# EAGLE design Lichtschranke_ArduinoBoard (EAGLE 6.4)
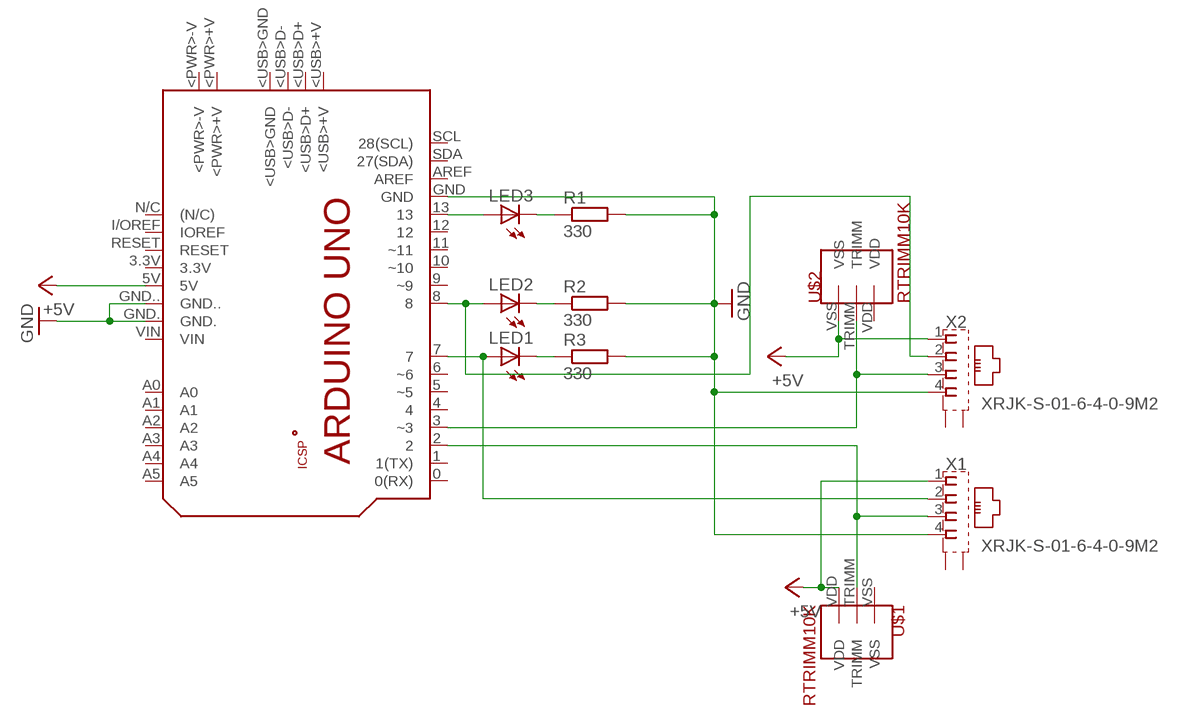
[diagram p0: schematic, sheet 1]

## Parts
LED1  LED5MM  [LED5MM]
LED2  LED5MM  [LED5MM]
LED3  LED5MM  [LED5MM]
PCB1  ARDUINO_UNO  [ARDUINO_UNO]
R1  330  R-EU_0411/12  [0411/12]
R2  330  R-EU_0411/12  [0411/12]
R3  330  R-EU_0411/12  [0411/12]
U$1  RTRIMM10K  [RTRIMM10K]
U$2  RTRIMM10K  [RTRIMM10K]
X1  XRJK-S-01-6-4-0-9M2  [XRJK-S-01-6-4-0-9M2]
X2  XRJK-S-01-6-4-0-9M2  [XRJK-S-01-6-4-0-9M2]

## Nets
+5V: PCB1.5V U$1.VDD U$2.VSS X1.1 X2.1
GND: PCB1.GND PCB1.GND. PCB1.GND.. R1.2 R2.2 R3.2 X1.4 X2.4
N$1: PCB1.3(~3) U$2.TRIMM X2.3
N$2: LED1.A PCB1.7 X1.2
N$3: LED2.A PCB1.8 X2.2
N$4: PCB1.2 U$1.TRIMM X1.3
N$5: LED3.A PCB1.13
N$6: LED3.K(C) R1.1
N$7: LED2.K(C) R2.1
N$8: LED1.K(C) R3.1
Unconnected: PCB1.0(0(RX)) PCB1.1(1(TX)) PCB1.3.3V PCB1.4 PCB1.5(~5) PCB1.6(~6) PCB1.9(~9) PCB1.10(~10) PCB1.11(~11) PCB1.12 PCB1.+5V PCB1.<PWR>+V PCB1.<PWR>-V PCB1.<USB>+V PCB1.<USB>D+ PCB1.<USB>D- PCB1.<USB>GND PCB1.A0 PCB1.A1 PCB1.A2 PCB1.A3 PCB1.A4 PCB1.A5 PCB1.AREF PCB1.GND_ PCB1.I/OREF(IOREF) PCB1.MISO PCB1.MOSI PCB1.N/C((N/C)) PCB1.RESET PCB1.RESET. PCB1.SCK PCB1.SCL(28(SCL)) PCB1.SDA(27(SDA)) PCB1.VIN U$1.VSS U$2.VDD X1.S1(S) X1.S2(S) X2.S1(S) X2.S2(S)

## Library data of the parts
LED1-LED3 = led:LED: LED OSRAM: - CHIPLED LG R971, LG N971, LY N971, LG Q971, LY Q971, LO R971, LY R971 LH N974, LH R974 LS Q976, LO Q976, LY Q976 LO Q996 - Hyper CHIPLED LW Q18S LB Q993, LB Q99A, LB R99A - SideLED LS A670, LO A670, LY A670, LG A670, LP A670 LB A673, LV A673, LT A673, LW A673 LH A674 LY A675 LS A676, LA A676, LO A676, LY A676, LW A676 LS A679, LY A679, LG A679 - Hyper Micro SIDELED® LS Y876, LA Y876, LO Y876, LY Y876 LT Y87S - SmartLED LW L88C, LW L88S LB L89C, LB L89S, LG L890 LS L89K, LO L89K, LY L89K LS L896, LA L896, LO L896, LY L896 - TOPLED LS T670, LO T670, LY T670, LG T670, LP T670 LSG T670, LSP T670, LSY T670, LOP T670, LYG T670 LG T671, LOG T671, LSG T671 LB T673, LV T673, LT T673, LW T673 LH T674 LS T676, LA T676, LO T676, LY T676, LB T676, LH T676, LSB T676, LW T676 LB T67C, LV T67C, LT T67C, LS T67K, LO T67K, LY T67K, LW E67C LS E67B, LA E67B, LO E67B, LY E67B, LB E67C, LV E67C, LT E67C LW T67C LS T679, LY T679, LG T679 LS T770, LO T770, LY T770, LG T770, LP T770 LB T773, LV T773, LT T773, LW T773 LH T774 LS E675, LA E675, LY E675, LS T675 LS T776, LA T776, LO T776, LY T776, LB T776 LHGB T686 LT T68C, LB T68C - Hyper Mini TOPLED® LB M676 - Mini TOPLED Santana® LG M470 LS M47K, LO M47K, LY M47K Source: http://www.osram.convergy.de LUXEON: - LUMILED® LXK2-PW12-R00, LXK2-PW12-S00, LXK2-PW14-U00, LXK2-PW14-V00 LXK2-PM12-R00, LXK2-PM12-S00, LXK2-PM14-U00 LXK2-PE12-Q00, LXK2-PE12-R00, LXK2-PE12-S00, LXK2-PE14-T00, LXK2-PE14-U00 LXK2-PB12-K00, LXK2-PB12-L00, LXK2-PB12-M00, LXK2-PB14-N00, LXK2-PB14-P00, LXK2-PB14-Q00 LXK2-PR12-L00, LXK2-PR12-M00, LXK2-PR14-Q00, LXK2-PR14-R00 LXK2-PD12-Q00, LXK2-PD12-R00, LXK2-PD12-S00 LXK2-PH12-R00, LXK2-PH12-S00 LXK2-PL12-P00, LXK2-PL12-Q00, LXK2-PL12-R00 Source: www.luxeon.com KINGBRIGHT: KA-3528ASYC Source: www.kingbright.com
PCB1 = E14_Arduino_published:ARDUINO_UNO: Device for representing an Arduino Uno board with a footprint in an EAGLE design. Created by Dave Young for Element14. More EAGLE documentation at: http://www.element14.com/community/community/knode/cadsoft_eagle
R1-R3 = resistor:R-EU_: RESISTOR, European symbol
U$1 U$2 = TrimmResistor:RTRIMM10K
X1 X2 = con-xmultiple:XRJK*4: RJ11 Connector without LED, 6 position, 4 contacts, thrue hole Source: XRJK-S-01-6-4-0-9M2(01).pdf

## Board
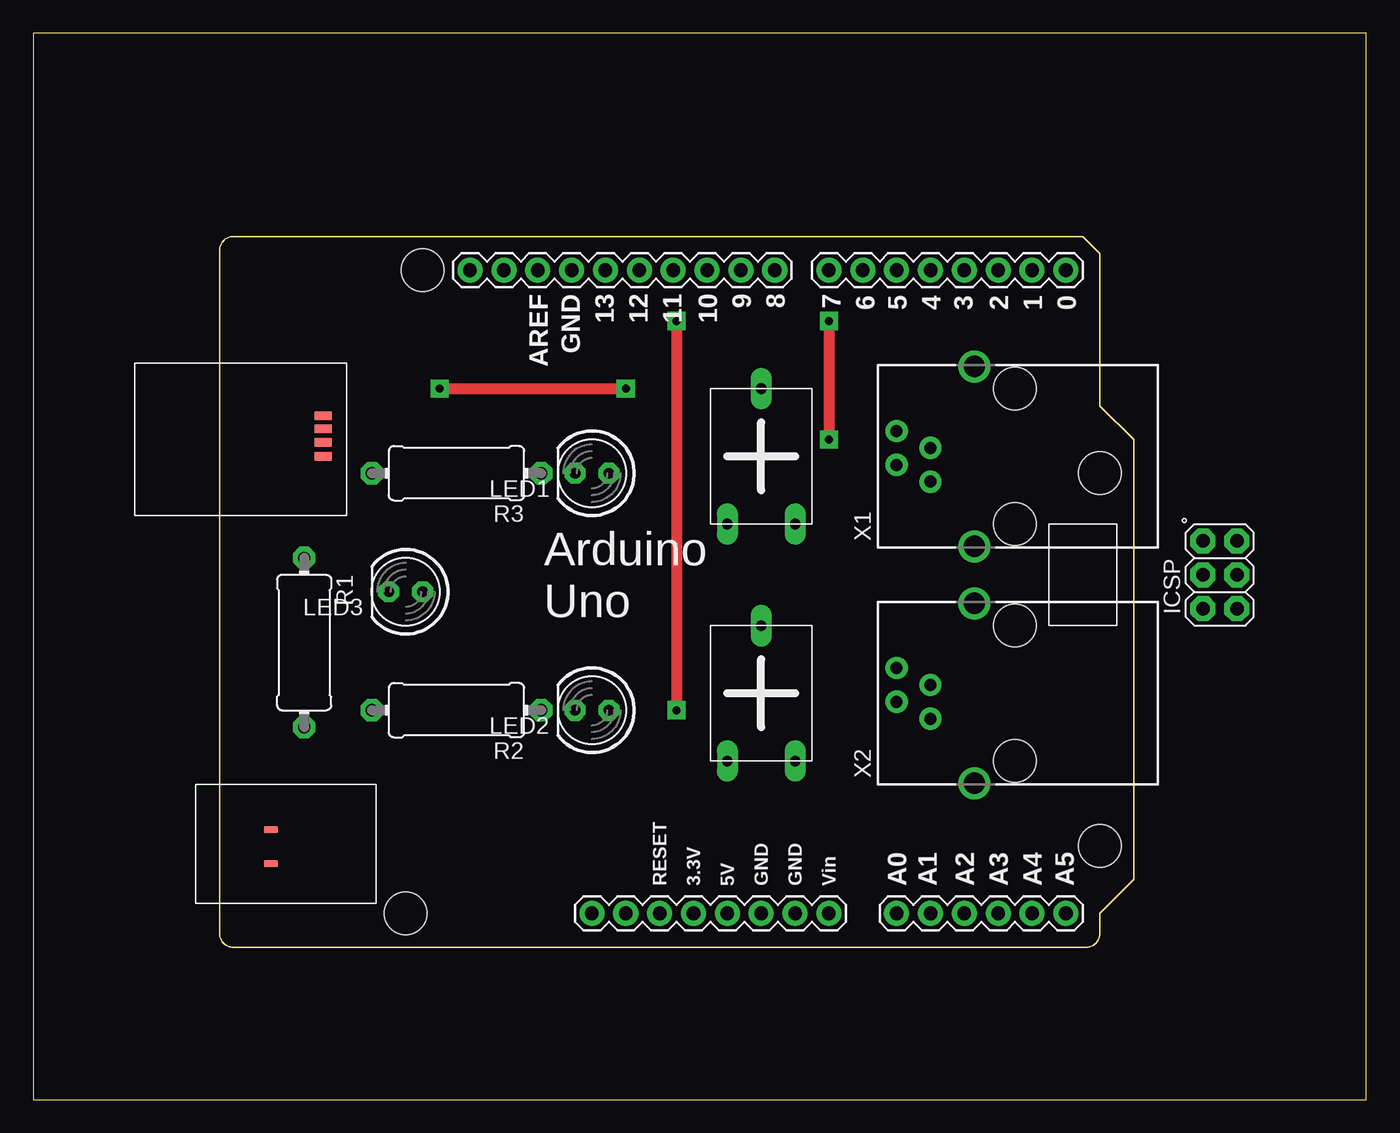
[diagram p1: board, top side]
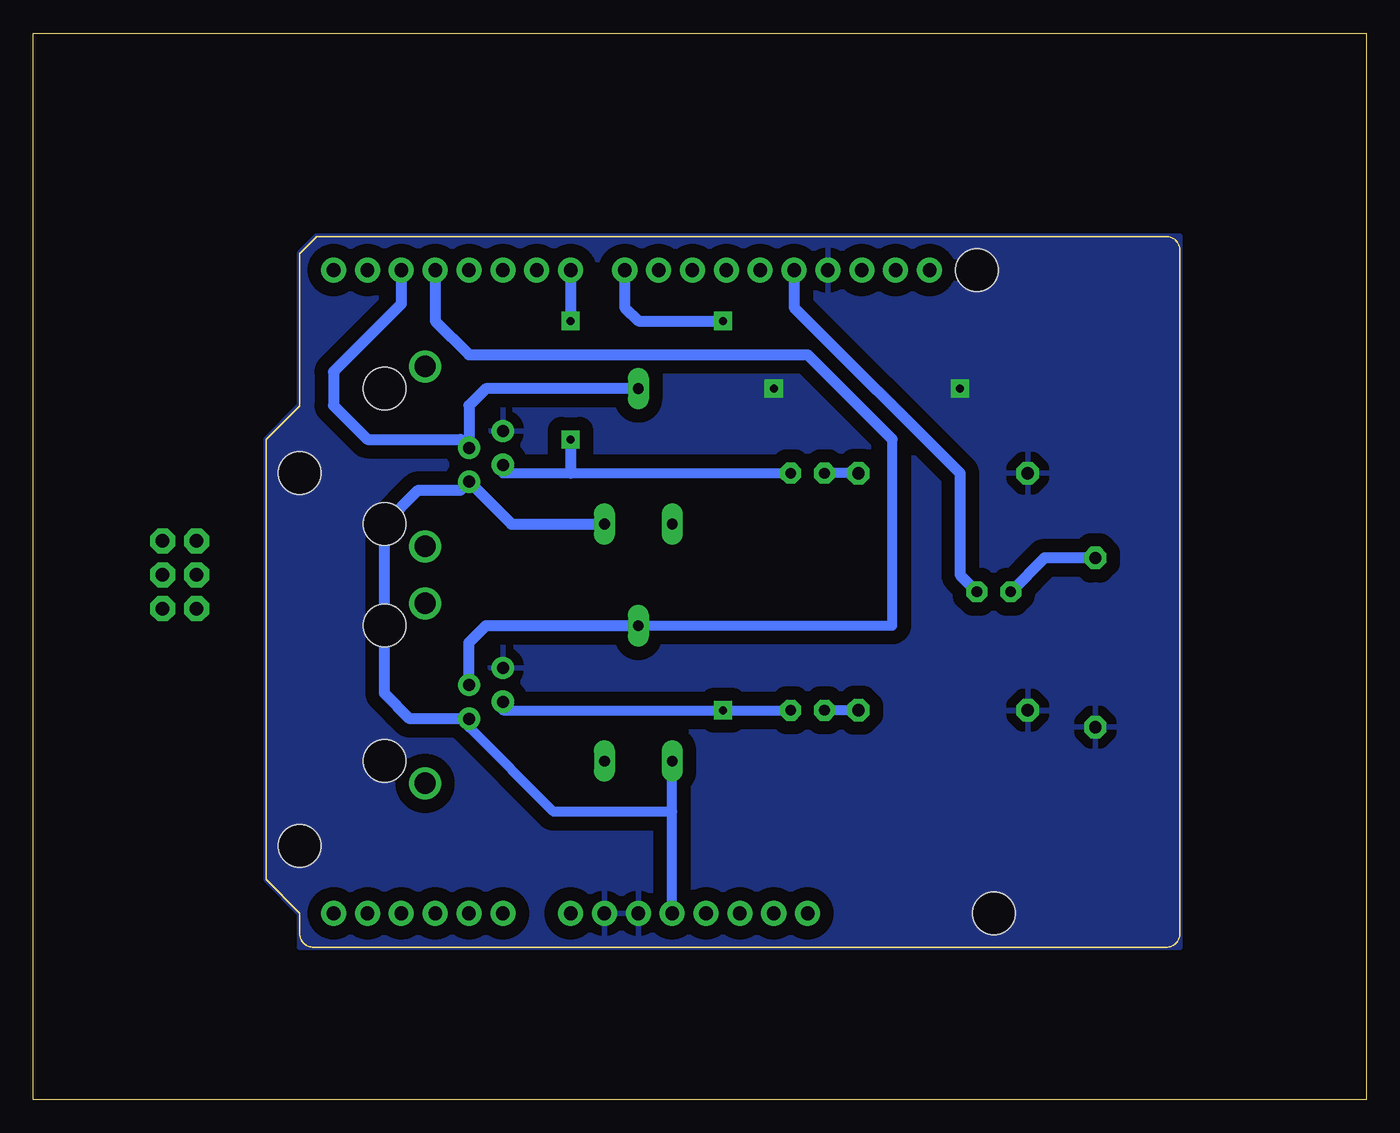
[diagram p2: board, bottom side, seen from below]

Size 100 x 80 mm. Coordinates in mm from the lower left corner, seen from the top.
Outline: 0,0 100,0 100,80 0,80 0,0
Copper layers (1+16): Top 0.035mm / dielectric 1.5mm / Bottom 0.035mm
Design rules "SelfEtching *": minimum track width 30mil, minimum drill 1mm, track to track 40mil, track to pad 40mil, pad to pad 40mil, via to via 40mil, smd to smd 8mil, copper to edge 0mil, drill to drill 30mil, minimum pad ring 15mil, minimum via ring 15mil, stop-mask expansion 4mil, vias tented up to drill 0mil, thermal gap 30mil

### Footprints (pad centres in the part's own frame; a part is rotated, then mirrored left to right if it is on the bottom)
LED5MM = drill 0.813 octagon: A -1.27,0; K 1.27,0
ARDUINO_UNO = drill 1.016 pad 1.88: 0 63.5,50.8; 1 60.96,50.8; 2 58.42,50.8; 3 55.88,50.8; 3.3V 35.56,2.54; 4 53.34,50.8; 5 50.8,50.8; 5V 38.1,2.54; 6 48.26,50.8; 7 45.72,50.8; 8 41.656,50.8; 9 39.116,50.8; 10 36.576,50.8; 11 34.036,50.8; 12 31.496,50.8; 13 28.956,50.8; A0 50.8,2.54; A1 53.34,2.54; A2 55.88,2.54; A3 58.42,2.54; A4 60.96,2.54; A5 63.5,2.54; AREF 23.876,50.8; GND 26.416,50.8; GND. 43.18,2.54; GND.. 40.64,2.54; I/OREF 30.48,2.54; N/C 27.94,2.54; RESET 33.02,2.54; SCL 18.796,50.8; SDA 21.336,50.8; VIN 45.72,2.54 | drill 1.016 pad 1.88 octagon: +5V 76.327,30.48; GND_ 76.327,25.4; MISO 73.787,30.48; MOSI 76.327,27.94; RESET. 73.787,25.4; SCK 73.787,27.94 | smd 1.016 x 0.508: <PWR>+V 3.861,8.814; <PWR>-V 3.861,6.274 | smd 1.27 x 0.635: <USB>+V 7.772,39.878; <USB>D+ 7.772,38.887; <USB>D- 7.772,37.871; <USB>GND 7.772,36.83 | hole 3.2: 66.04,7.62; 66.04,35.56; 15.24,50.8; 13.97,2.54
0411/12 = drill 0.914 octagon: 1 -6.35,0; 2 6.35,0
RTRIMM10K = drill 0.8 long: TRIMM 2.54,-10.16; VDD 0,0; VSS 5.08,0
XRJK-S-01-6-4-0-9M2 = drill 0.9 pad 1.5: 1 -1.905,6.35; 2 -0.635,8.89; 3 0.635,6.35; 4 1.905,8.89 | drill 1.6 pad 2.184: S1 -6.75,3.05; S2 6.75,3.05 | hole 3.2: -5.08,0; 5.08,0

### Placement (x,y rotation side)
LED1  41.91,46.99 180 top
LED2  41.91,29.21 180 top
LED3  27.94,38.1 180 top
PCB1  13.97,11.43 0 top
R1  20.32,34.29 270 top
R2  31.75,29.21 180 top
R3  31.75,46.99 180 top
U$1  57.15,43.18 180 top
U$2  57.15,25.4 180 top
X1  73.66,48.26 90 top
X2  73.66,30.48 90 top

### Tracks (layer width: path | path; a pad name or v marks a point on that pad's centre or on a via)
+5V
  Bottom 0.762: PCB1.5V 52.07,21.59 | 52.07,21.59 U$2.VSS | 52.07,21.59 60.96,21.59 67.31,27.94 X2.1
  Bottom 0.813: U$1.VDD 64.14,43.18 X1.1 67.94,45.72 71.12,45.72 73.66,43.18 73.66,30.48 71.75,28.57 X2.1
GND  (via drill 0.6)
  Top 0.813: v30.48,53.34 v44.45,53.34
  pour Bottom: 13.97,11.43 13.97,64.77 78.74,64.77 80.01,63.5 80.01,52.07 82.55,49.53 82.55,16.51 80.01,13.97 80.01,11.43
N$1
  Bottom 0.762: 35.56,49.53 35.56,35.56 U$2.TRIMM
  Bottom 0.813: PCB1.3 69.85,58.42 67.31,55.88 41.91,55.88 35.56,49.53 | X2.3 67.31,34.29 66.04,35.56 U$2.TRIMM
N$2  (via drill 0.6)
  Top 0.813: v59.69,58.42 v59.69,49.53
  Bottom 0.762: LED1.A 59.69,46.99 64.77,46.99 X1.2
  Bottom 0.813: PCB1.7 v59.69,58.42 | v59.69,49.53 59.69,46.99
N$3  (via drill 0.6)
  Top 0.813: v48.26,58.42 v48.26,29.21
  Bottom 0.762: LED2.A v48.26,29.21 64.77,29.21 X2.2
  Bottom 0.813: PCB1.8 55.63,59.44 54.61,58.42 v48.26,58.42
N$4
  Bottom 0.813: U$1.TRIMM 66.04,53.34 67.31,52.07 X1.3 67.94,49.53 74.93,49.53 77.47,52.07 77.47,54.61 72.39,59.69 PCB1.2
N$5
  Bottom 0.813: PCB1.13 42.93,59.44 30.48,46.99 30.48,39.37 LED3.A
N$6
  Bottom 0.813: R1.1 24.13,40.64 LED3.K
N$7
  Bottom 0.762: R2.1 LED2.K
N$8
  Bottom 0.762: R3.1 LED1.K